# EAGLE schematic motion sensor and load (EAGLE 6.3)
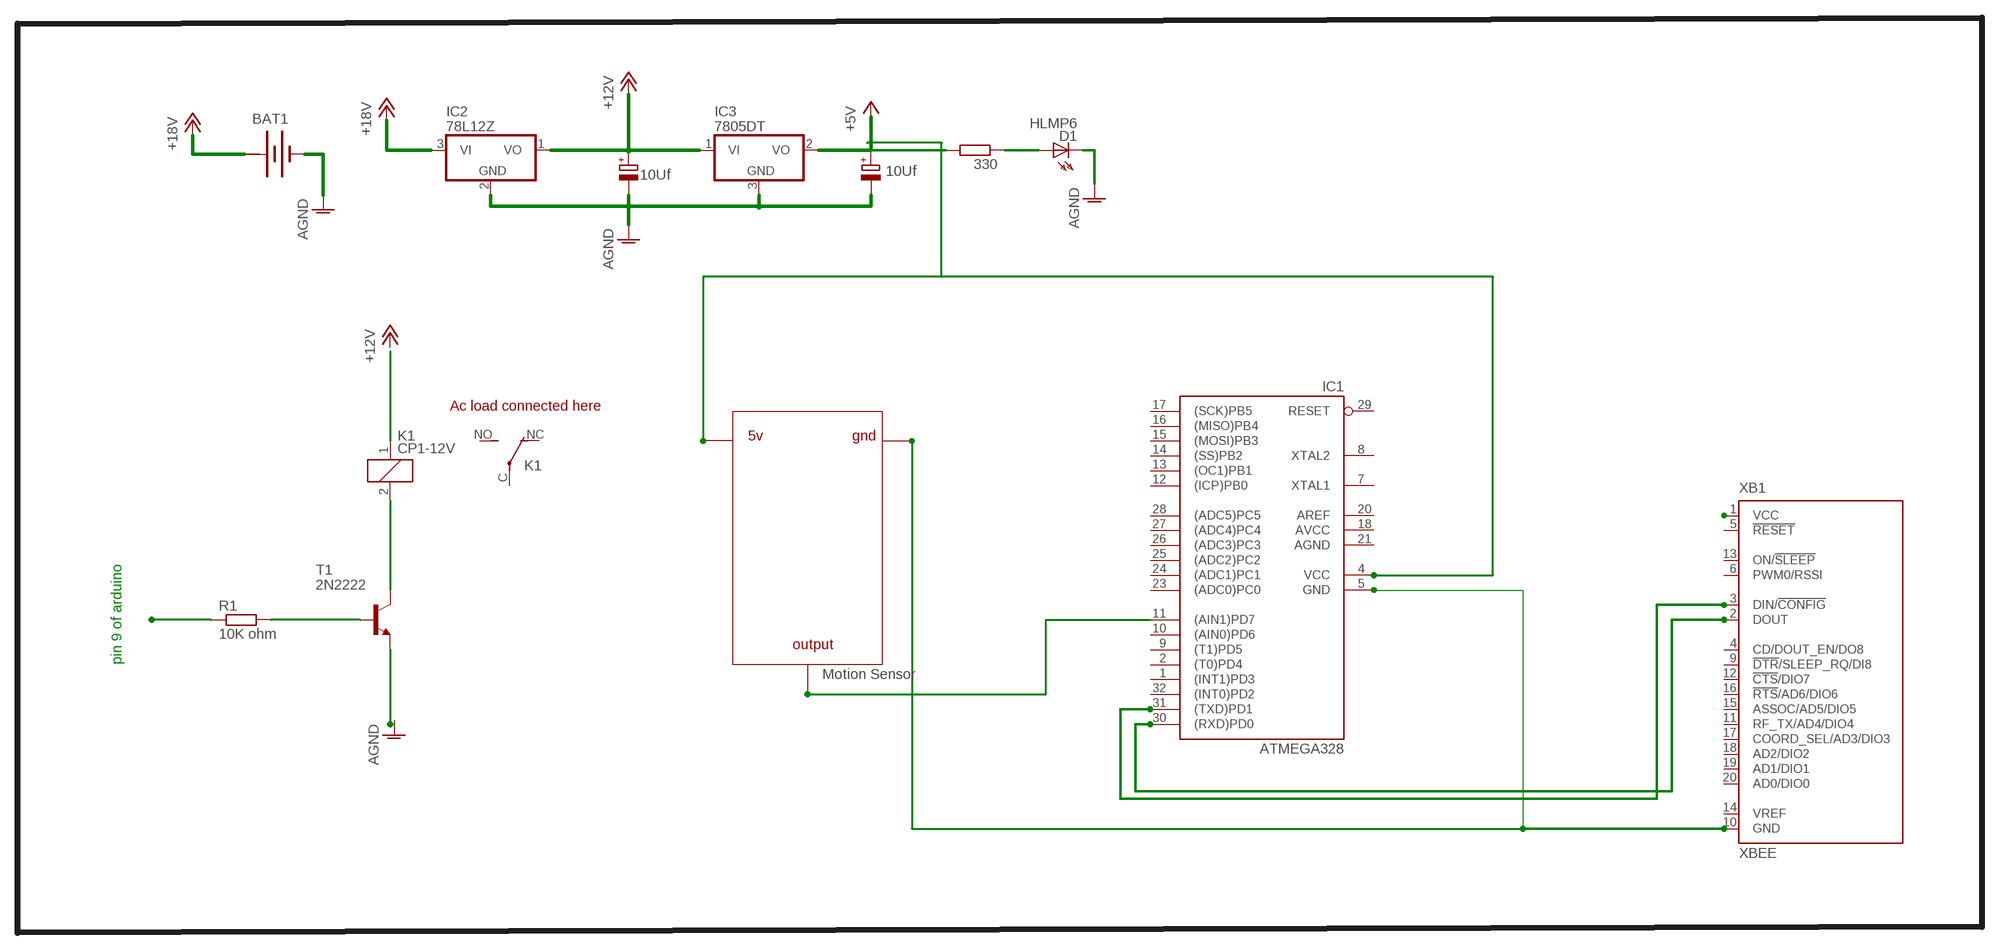
[diagram p0: schematic, sheet 1]

## Parts
330  R-EU_0204/2V  [0204V]
BAT1  BATTERY  [BATTERY]
D1  HLMP6  [HLMP6]
IC1  ATMEGA328  AT90S2333AA  [TQFP32-08]
IC2  78L12Z  [TO92]
IC3  7805DT  [TO252]
K1  CP1-12V  [CP1]
R1  10K ohm  R-EU_0204/5  [0204/5]
T1  2N2222  [TO18]
XB1  XBEE  [XBEE]

## Nets
+5V: 330.2 IC3.2(VO)
+12V: BAT1.+ IC2.1(VO) IC2.3(VI) IC3.1(VI) ; supply symbol labelled +18V
AGND: BAT1.- D1.K IC2.2(GND) IC3.3(GND)
N$1: IC1.11((AIN1)PD7)
N$2: K1.1
N$3: K1.2 T1.3(C)
N$4: 330.1 D1.A
N$5: IC1.4(VCC)
N$6: T1.1(E)
N$7: R1.2 T1.2(B)
N$8: R1.1
N$16: XB1.1(VCC)
N$17: IC1.5(GND) XB1.10(GND)
N$20: IC1.30((RXD)PD0) XB1.2(DOUT)
N$21: IC1.31((TXD)PD1) XB1.3(DIN/!CONFIG)
Unconnected: IC1.1((INT1)PD3) IC1.2((T0)PD4) IC1.3(NC1) IC1.6(NC2) IC1.7(XTAL1) IC1.8(XTAL2) IC1.9((T1)PD5) IC1.10((AIN0)PD6) IC1.12((ICP)PB0) IC1.13((OC1)PB1) IC1.14((SS)PB2) IC1.15((MOSI)PB3) IC1.16((MISO)PB4) IC1.17((SCK)PB5) IC1.19(NC3) IC1.20(AREF) IC1.22(NC4) IC1.23((ADC0)PC0) IC1.24((ADC1)PC1) IC1.25((ADC2)PC2) IC1.26((ADC3)PC3) IC1.27((ADC4)PC4) IC1.28((ADC5)PC5) IC1.29(RESET) IC1.32((INT0)PD2) K1.C(2:P) K1.NC(2:O) K1.NO(2:S) XB1.4(CD/DOUT_EN/DO8) XB1.5(!RESET) XB1.6(PWM0/RSSI) XB1.9(!DTR!/SLEEP_RQ/DI8) XB1.11(RF_TX/AD4/DIO4) XB1.12(!CTS!/DIO7) XB1.13(ON/!SLEEP) XB1.14(VREF) XB1.15(ASSOC/AD5/DIO5) XB1.16(!RTS!/AD6/DIO6) XB1.17(COORD_SEL/AD3/DIO3) XB1.18(AD2/DIO2) XB1.19(AD1/DIO1) XB1.20(AD0/DIO0)

## Notes on the sheet
- 10Uf | 10Uf
- Ac load connected here
- 5v | gnd
- output
- pin 9 of arduino
- Motion Sensor

## Power pins joined to a net without a drawn wire
+: BAT1.+@1(+)
AGND: IC1.21(AGND)
AVCC: IC1.18(AVCC)

## Library data of the parts
330 = resistor:R-EU_: RESISTOR, European symbol
BAT1 = special:BATTERY: BATTERY
D1 = display-hp:HLMP6: LED 2mm horizontal
IC1 = atmel:AT90S2333A: MICROCONTROLLER 2 Kbytes FLASH 128 bytes SRAM 128 bytes EEPROM UART 6-channel 10-bit ADC; OC_FARNELL: unknown; OC_NEWARK: unknown
IC2 IC3 = linear:78*: Positive VOLTAGE REGULATOR Source: http://cache.national.com/ds/LM/LM78L05.pdf http://www.fairchildsemi.com/ds/LM/LM7805.pdf
K1 = relay:CP1?-*: ULTRA-MINIATURE LOW PROFILE AUTOMOTIVE RELAY NAiS Source: http://www.mew-europe.com/.. en_ds_61207_0000.pdf; MF: AROMAT/ MATSUSHITA; MPN: CP1-12V; OC_FARNELL: unknown; OC_NEWARK: 10C5508
R1 = rcl:R-EU_: RESISTOR, European symbol
T1 = transistor:2N2222: NPN TRANSISTOR
XB1 = maxstream:XBEE: XBee (TM) /XBee-PRO(TM) OEM RF Modules Source: MaxStream, Inc. xbee_productmanual.pdf; MPN: XBP24-Z7UIT-004; OC_FARNELL: 1751799; OC_NEWARK: 34R5507